# Altium schematic sheet sockets.schdoc: SCKT
size A4; Date: 08.29.2026; CheckedBy: azhaoii; DrawnBy: miaow; Revision: v1.0.0; SheetNumber: 2; SheetTotal: 3; Sample: A0; Url: github.com/miaow-cn/pwrhub-hw; Liscense: CC-BY-SA-4.0; Board: Power Hub; BoardType: MAIN; Desc: 6 channel buck
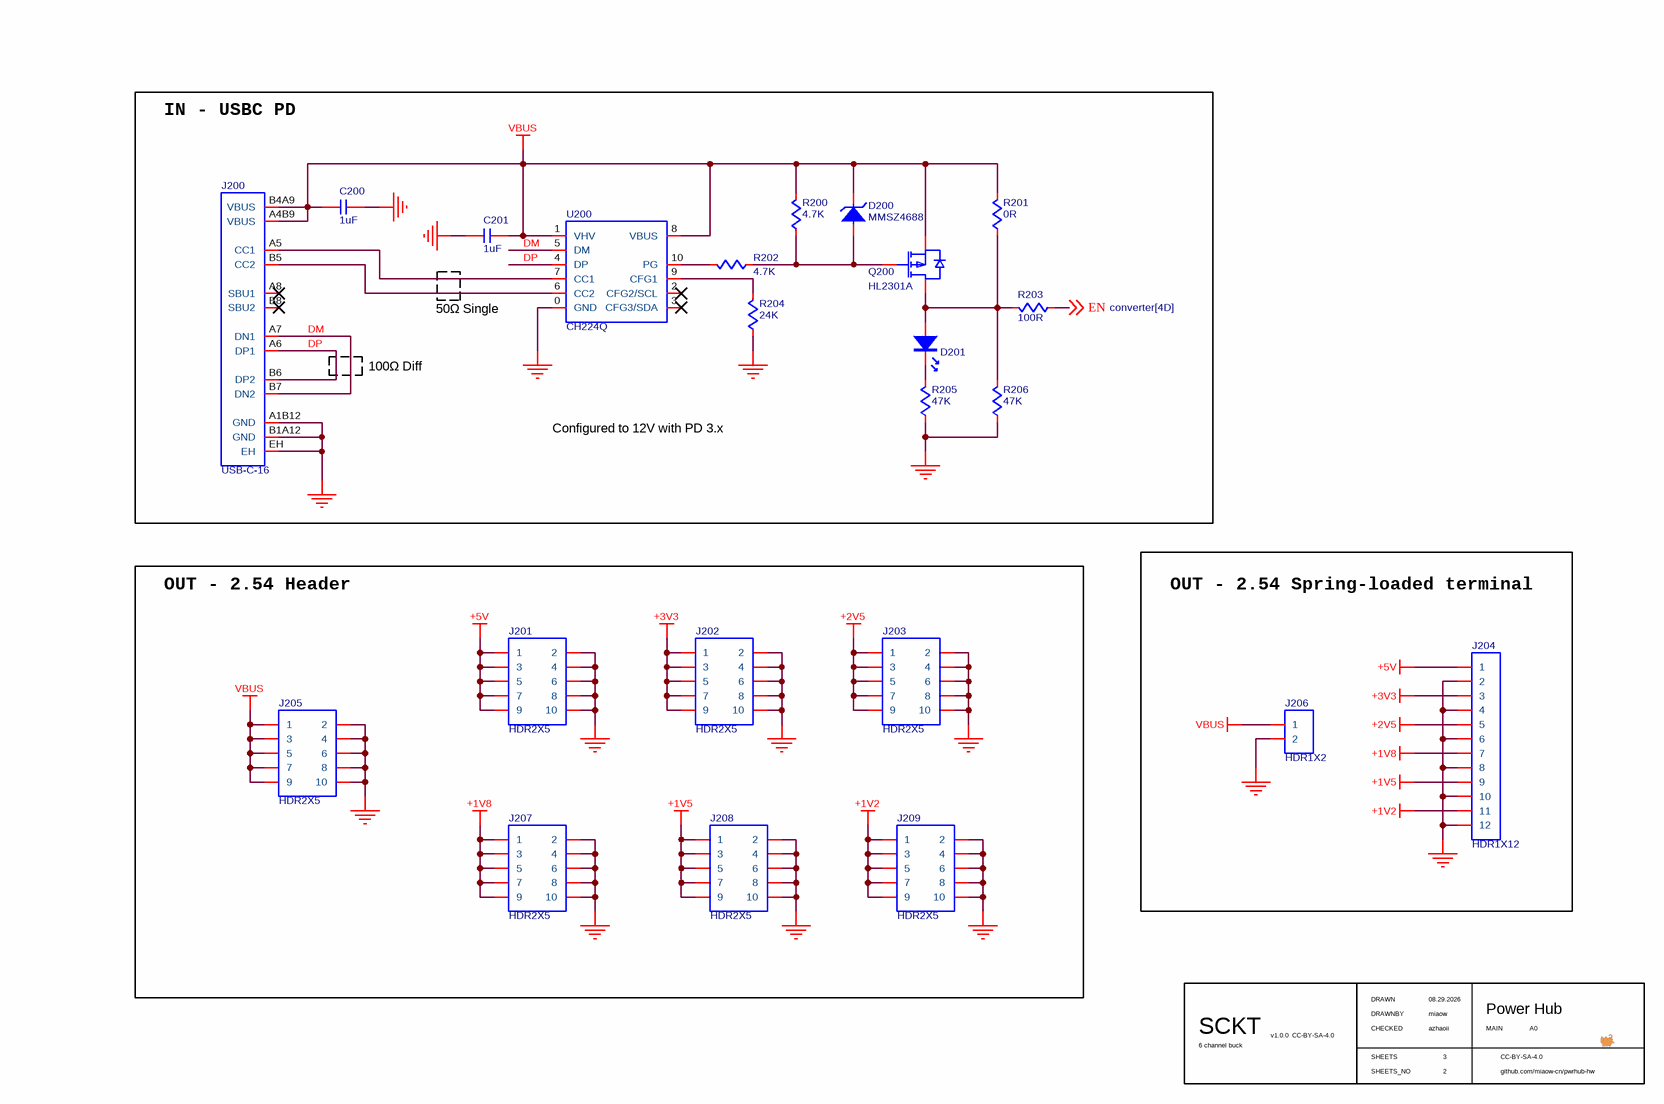
[diagram p0: sockets.schdoc]

## Parts
C200  value 1uF  [C0402]  (hidden comment: C-NOMO)
C201  value 1uF  [C0402]  (hidden comment: C-NOMO)
D200  MMSZ4688  [MMSZ4688]
D201  LED  [LED0603]  (value not drawn)
J200  USB-C-16  [USB-C-16]
J201  HDR2X5  [HDR2X5]
J202  HDR2X5  [HDR2X5]
J203  HDR2X5  [HDR2X5]
J204  HDR1X12  [KF141R-2.54-12P]
J205  HDR2X5  [HDR2X5]
J206  HDR1X2  [KF141R-2.54-2P]
J207  HDR2X5  [HDR2X5]
J208  HDR2X5  [HDR2X5]
J209  HDR2X5  [HDR2X5]
Q200  HL2301A  [HL2301A]
R200  value 4.7K  [R0402]  (hidden comment: R)
R201  value 0R  [R0402]  (hidden comment: R)
R202  value 4.7K  [R0402]  (hidden comment: R)
R203  value 100R  [R0402]  (hidden comment: R)
R204  value 24K  [R0402]  (hidden comment: R)
R205  value 47K  [R0402]  (hidden comment: R)
R206  value 47K  [R0402]  (hidden comment: R)
U200  CH224Q  [CH224Q]

## Blocks framed on the sheet
IN - USBC PD: C200 C201 D200 D201 J200 Q200 R200-R206 U200
OUT - 2.54 Spring-loaded terminal: J204 J206
OUT - 2.54 Header: J201-J203 J205 J207-J209

## Nets
+1V2: J204.11 J209.1 J209.3 J209.5 J209.7 J209.9
+1V5: J204.9 J208.1 J208.3 J208.5 J208.7 J208.9
+1V8: J204.7 J207.1 J207.3 J207.5 J207.7 J207.9
+2V5: J203.1 J203.3 J203.5 J203.7 J203.9 J204.5
+3V3: J202.1 J202.3 J202.5 J202.7 J202.9 J204.3
+5V: J201.1 J201.3 J201.5 J201.7 J201.9 J204.1
GND: C200.1 C201.1 J200.A1B12(GND) J200.B1A12(GND) J200.EH J201.2 J201.4 J201.6 J201.8 J201.10 J202.2 J202.4 J202.6 J202.8 J202.10 J203.2 J203.4 J203.6 J203.8 J203.10 J204.2 J204.4 J204.6 J204.8 J204.10 J204.12 J205.2 J205.4 J205.6 J205.8 J205.10 J206.2 J207.2 J207.4 J207.6 J207.8 J207.10 J208.2 J208.4 J208.6 J208.8 J208.10 J209.2 J209.4 J209.6 J209.8 J209.10 R204.2 R205.2 R206.2 U200.0(GND)
VBUS: C200.2 C201.2 D200.1(C) J200.A4B9(VBUS) J200.B4A9(VBUS) J205.1 J205.3 J205.5 J205.7 J205.9 J206.1 Q200.S R200.1 R201.1 U200.1(VHV) U200.8(VBUS)
DM: J200.A7(DN1) J200.B7(DN2) U200.5(DM)
DP: J200.A6(DP1) J200.B6(DP2) U200.4(DP)
EN: R203.2 ; off-sheet EN
NetD200_2: D200.2(A) Q200.G R200.2 R202.2
NetD201_1: D201.1 R205.1
NetD201_2: D201.2 Q200.D R201.2 R203.1 R206.1
NetJ200_A5: J200.A5(CC1) U200.7(CC1)
NetJ200_B5: J200.B5(CC2) U200.6(CC2)
NetR202_1: R202.1 U200.10(PG)
NetR204_1: R204.1 U200.9(CFG1)

Not connected (* = marked no-connect by the designer): J200 A8(SBU1)* B8(SBU2)*; U200 2(CFG2/SCL)* 3(CFG3/SDA)*

## Notes on the sheet
- 50Ω Single
- 100Ω Diff
- Configured to 12V with PD 3.x
- DRAWN
- CHECKED
- DRAWNBY
- SHEETS
- SHEETS_NO

## Library data of the parts
C200 C201 = C-NOMO: voltage: 25V; precision: 5%
D200 = MMSZ4688: ZENER; Supplier 1: LCSC; Supplier Part Number 1: C22395547
Q200 = HL2301A: PMOS; Supplier 1: LCSC; Supplier Part Number 1: C7420344
R200-R206 = R: precision: 1%
U200 = CH224Q: PD3.2; Supplier 1: LCSC; Supplier Part Number 1: C46061833
J200 = USB-C-16: Supplier 1: LCSC; Supplier Part Number 1: C165948
J201-J203 J205 J207-J209 = HDR2X5: Supplier 1: LCSC; Supplier 2: LCSC; Supplier Part Number 2: C5665; Supplier Part Number 3: C22392240; Supplier 3: LCSC; Supplier Part Number 4: C3975188; Supplier 4: LCSC; Supplier Part Number 1: C225520
J204 = HDR1X12: Supplier 1: LCSC; Supplier Part Number 1: C2840012; Supplier 2: LCSC; Supplier Part Number 2: C475133
J206 = HDR1X2: Supplier 1: LCSC; Supplier Part Number 1: C474881; Supplier 2: LCSC; Supplier Part Number 2: C225477; Supplier 3: LCSC; Supplier Part Number 3: C20079; Supplier 4: LCSC; Supplier Part Number 4: C475124